# Altium schematic sheet Top Layer.SchDoc
size A4
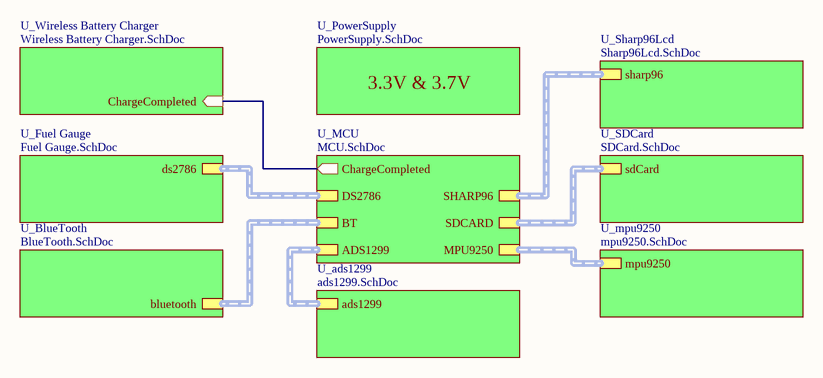
[diagram p0: Top Layer.SchDoc]

## Sub-sheets
U_ads1299 = ads1299.SchDoc: ads1299 (harness ads1299)
U_BlueTooth = BlueTooth.SchDoc: bluetooth (harness bluetooth)
U_Fuel Gauge = Fuel Gauge.SchDoc: ds2786 (harness ds2786)
U_MCU = MCU.SchDoc: ADS1299 (harness ads1299), MPU9250 (harness mpu9250), DS2786 (harness ds2786), SHARP96 (harness sharp96), SDCARD (harness sdCard), BT (harness bluetooth), ChargeCompleted (out)
U_mpu9250 = mpu9250.SchDoc: mpu9250 (harness mpu9250)
U_PowerSupply = PowerSupply.SchDoc: no entries
U_SDCard = SDCard.SchDoc: sdCard (harness sdCard)
U_Sharp96Lcd = Sharp96Lcd.SchDoc: sharp96 (harness sharp96)
U_Wireless Battery Charger = Wireless Battery Charger.SchDoc: ChargeCompleted (in)

## Nets
(unnamed): sheet U_Wireless Battery Charger/ChargeCompleted, sheet U_MCU/ChargeCompleted

## Buses and harness runs
harness sheet U_ads1299/ads1299 = sheet U_MCU/ADS1299
harness sheet U_BlueTooth/bluetooth = sheet U_MCU/BT
harness sheet U_Fuel Gauge/ds2786 = sheet U_MCU/DS2786
harness sheet U_MCU/MPU9250 = sheet U_mpu9250/mpu9250
harness sheet U_MCU/SDCARD = sheet U_SDCard/sdCard
harness sheet U_MCU/SHARP96 = sheet U_Sharp96Lcd/sharp96

## Notes on the sheet
- 3.3V & 3.7V